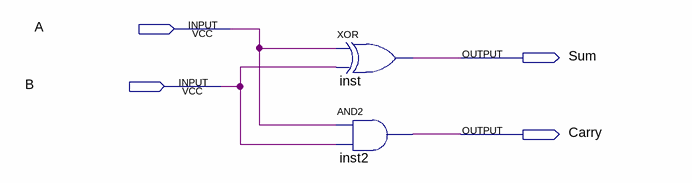
[diagram p0: schematic sheet]
// Quartus schematic half_adder_diagram.bdf as structural Verilog: 2 symbols, 4 pins
module half_adder_diagram (
  input  A,
  input  B,
  output Sum,
  output Carry
);

  xor inst (Sum, A, B);
  and inst2 (Carry, A, B);
endmodule
